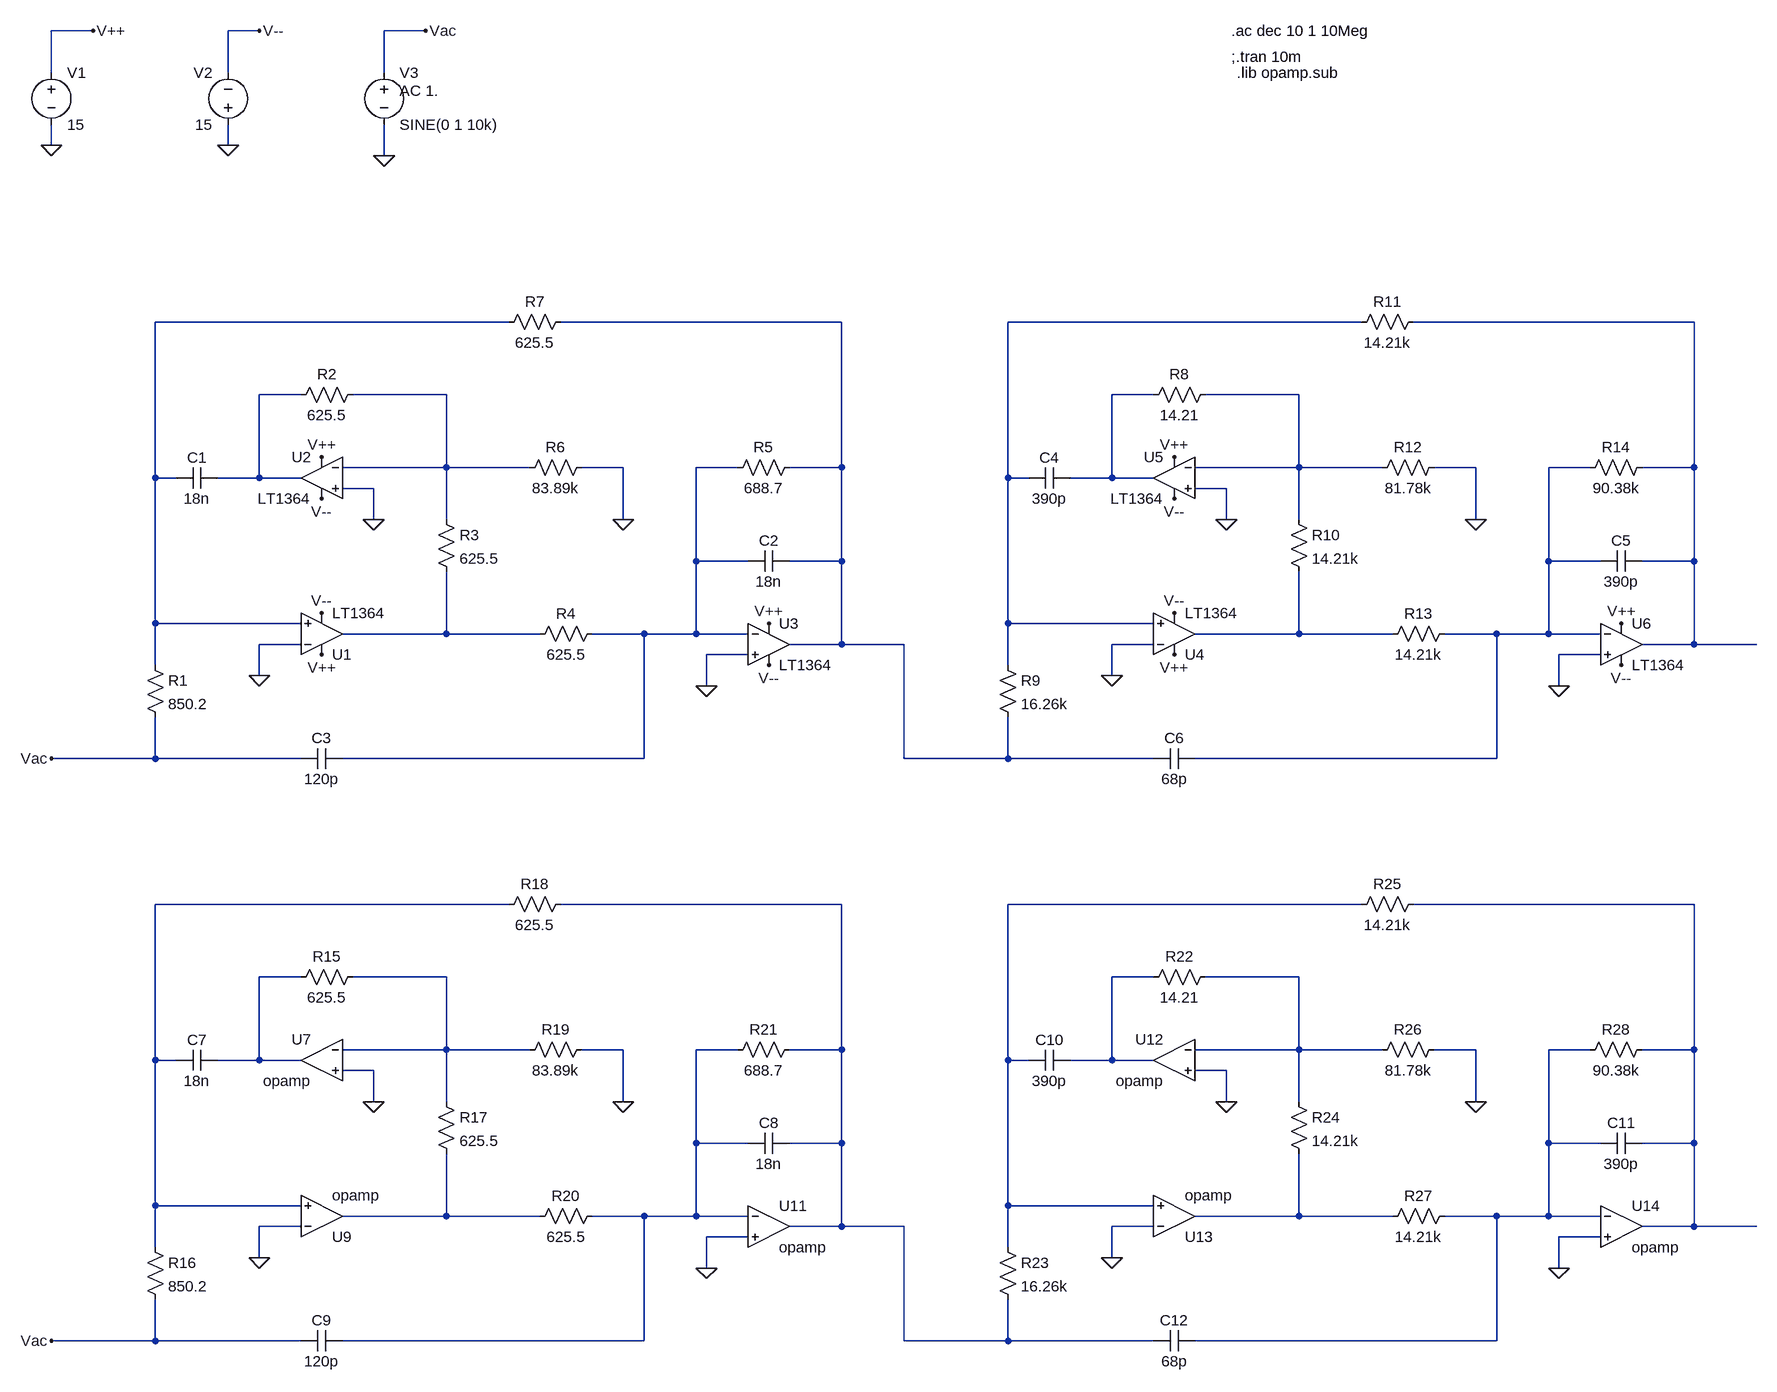
[diagram p0: schematic LT1364_Cauer_AM.asc]
LT1364_Cauer_AM.asc, the LTspice schematic file:
Version 4
SHEET 1 2456 1436
WIRE -304 -640 -368 -640
WIRE -48 -640 -96 -640
WIRE 208 -640 144 -640
WIRE -368 -576 -368 -640
WIRE -96 -576 -96 -640
WIRE 144 -576 144 -640
WIRE -368 -464 -368 -496
WIRE -96 -464 -96 -496
WIRE 144 -448 144 -496
WIRE 336 -192 -208 -192
WIRE 848 -192 416 -192
WIRE 1648 -192 1104 -192
WIRE 2160 -192 1728 -192
WIRE 16 -80 -48 -80
WIRE 240 -80 96 -80
WIRE 1328 -80 1264 -80
WIRE 1552 -80 1408 -80
WIRE 240 32 240 -80
WIRE 240 32 80 32
WIRE 368 32 240 32
WIRE 512 32 448 32
WIRE 688 32 624 32
WIRE 848 32 848 -192
WIRE 848 32 768 32
WIRE 1552 32 1552 -80
WIRE 1552 32 1392 32
WIRE 1680 32 1552 32
WIRE 1824 32 1760 32
WIRE 2000 32 1936 32
WIRE 2160 32 2160 -192
WIRE 2160 32 2080 32
WIRE -208 48 -208 -192
WIRE -176 48 -208 48
WIRE -48 48 -48 -80
WIRE -48 48 -112 48
WIRE 16 48 -48 48
WIRE 1104 48 1104 -192
WIRE 1136 48 1104 48
WIRE 1264 48 1264 -80
WIRE 1264 48 1200 48
WIRE 1328 48 1264 48
WIRE 128 64 80 64
WIRE 1440 64 1392 64
WIRE 128 112 128 64
WIRE 240 112 240 32
WIRE 512 112 512 32
WIRE 1440 112 1440 64
WIRE 1552 112 1552 32
WIRE 1824 112 1824 32
WIRE 624 176 624 32
WIRE 704 176 624 176
WIRE 848 176 848 32
WIRE 848 176 768 176
WIRE 1936 176 1936 32
WIRE 2016 176 1936 176
WIRE 2160 176 2160 32
WIRE 2160 176 2080 176
WIRE -208 272 -208 48
WIRE 16 272 -208 272
WIRE 1104 272 1104 48
WIRE 1328 272 1104 272
WIRE 240 288 240 192
WIRE 240 288 80 288
WIRE 384 288 240 288
WIRE 544 288 464 288
WIRE 624 288 624 176
WIRE 624 288 544 288
WIRE 704 288 624 288
WIRE 1552 288 1552 192
WIRE 1552 288 1392 288
WIRE 1696 288 1552 288
WIRE 1856 288 1776 288
WIRE 1936 288 1936 176
WIRE 1936 288 1856 288
WIRE 2016 288 1936 288
WIRE 16 304 -48 304
WIRE 848 304 848 176
WIRE 848 304 768 304
WIRE 944 304 848 304
WIRE 1328 304 1264 304
WIRE 2160 304 2160 176
WIRE 2160 304 2080 304
WIRE 2256 304 2160 304
WIRE 704 320 640 320
WIRE 2016 320 1952 320
WIRE -208 336 -208 272
WIRE 1104 336 1104 272
WIRE -48 352 -48 304
WIRE 1264 352 1264 304
WIRE 640 368 640 320
WIRE 1952 368 1952 320
WIRE -208 480 -208 416
WIRE -208 480 -368 480
WIRE 16 480 -208 480
WIRE 544 480 544 288
WIRE 544 480 80 480
WIRE 944 480 944 304
WIRE 1104 480 1104 416
WIRE 1104 480 944 480
WIRE 1328 480 1104 480
WIRE 1856 480 1856 288
WIRE 1856 480 1392 480
WIRE 336 704 -208 704
WIRE 848 704 416 704
WIRE 1648 704 1104 704
WIRE 2160 704 1728 704
WIRE 16 816 -48 816
WIRE 240 816 96 816
WIRE 1328 816 1264 816
WIRE 1552 816 1408 816
WIRE 240 928 240 816
WIRE 240 928 80 928
WIRE 368 928 240 928
WIRE 512 928 448 928
WIRE 688 928 624 928
WIRE 848 928 848 704
WIRE 848 928 768 928
WIRE 1552 928 1552 816
WIRE 1552 928 1392 928
WIRE 1680 928 1552 928
WIRE 1824 928 1760 928
WIRE 2000 928 1936 928
WIRE 2160 928 2160 704
WIRE 2160 928 2080 928
WIRE -208 944 -208 704
WIRE -176 944 -208 944
WIRE -48 944 -48 816
WIRE -48 944 -112 944
WIRE 16 944 -48 944
WIRE 1104 944 1104 704
WIRE 1136 944 1104 944
WIRE 1264 944 1264 816
WIRE 1264 944 1200 944
WIRE 1328 944 1264 944
WIRE 128 960 80 960
WIRE 1440 960 1392 960
WIRE 128 1008 128 960
WIRE 240 1008 240 928
WIRE 512 1008 512 928
WIRE 1440 1008 1440 960
WIRE 1552 1008 1552 928
WIRE 1824 1008 1824 928
WIRE 624 1072 624 928
WIRE 704 1072 624 1072
WIRE 848 1072 848 928
WIRE 848 1072 768 1072
WIRE 1936 1072 1936 928
WIRE 2016 1072 1936 1072
WIRE 2160 1072 2160 928
WIRE 2160 1072 2080 1072
WIRE -208 1168 -208 944
WIRE 16 1168 -208 1168
WIRE 1104 1168 1104 944
WIRE 1328 1168 1104 1168
WIRE 240 1184 240 1088
WIRE 240 1184 80 1184
WIRE 384 1184 240 1184
WIRE 544 1184 464 1184
WIRE 624 1184 624 1072
WIRE 624 1184 544 1184
WIRE 704 1184 624 1184
WIRE 1552 1184 1552 1088
WIRE 1552 1184 1392 1184
WIRE 1696 1184 1552 1184
WIRE 1856 1184 1776 1184
WIRE 1936 1184 1936 1072
WIRE 1936 1184 1856 1184
WIRE 2016 1184 1936 1184
WIRE 16 1200 -48 1200
WIRE 848 1200 848 1072
WIRE 848 1200 768 1200
WIRE 944 1200 848 1200
WIRE 1328 1200 1264 1200
WIRE 2160 1200 2160 1072
WIRE 2160 1200 2080 1200
WIRE 2256 1200 2160 1200
WIRE 704 1216 640 1216
WIRE 2016 1216 1952 1216
WIRE -208 1232 -208 1168
WIRE 1104 1232 1104 1168
WIRE -48 1248 -48 1200
WIRE 1264 1248 1264 1200
WIRE 640 1264 640 1216
WIRE 1952 1264 1952 1216
WIRE -208 1376 -208 1312
WIRE -208 1376 -368 1376
WIRE 16 1376 -208 1376
WIRE 544 1376 544 1184
WIRE 544 1376 80 1376
WIRE 944 1376 944 1200
WIRE 1104 1376 1104 1312
WIRE 1104 1376 944 1376
WIRE 1328 1376 1104 1376
WIRE 1856 1376 1856 1184
WIRE 1856 1376 1392 1376
FLAG -368 -464 0
FLAG -96 -464 0
FLAG -304 -640 V++
FLAG -48 -640 V--
FLAG 144 -448 0
FLAG 208 -640 Vac
FLAG 736 336 V--
FLAG 736 272 V++
FLAG 48 80 V--
FLAG 48 16 V++
FLAG 48 256 V--
FLAG 48 320 V++
FLAG 640 368 0
FLAG -48 352 0
FLAG 512 112 0
FLAG 128 112 0
FLAG 1952 368 0
FLAG 1264 352 0
FLAG 1824 112 0
FLAG 1440 112 0
FLAG -368 480 Vac
FLAG 640 1264 0
FLAG -48 1248 0
FLAG 512 1008 0
FLAG 128 1008 0
FLAG 1952 1264 0
FLAG 1264 1248 0
FLAG 1824 1008 0
FLAG 1440 1008 0
FLAG -368 1376 Vac
FLAG 2048 336 V--
FLAG 2048 272 V++
FLAG 1360 256 V--
FLAG 1360 320 V++
FLAG 1360 80 V--
FLAG 1360 16 V++
SYMBOL res 112 -96 R90
WINDOW 0 0 56 VBottom 2
WINDOW 3 32 56 VTop 2
SYMATTR InstName R2
SYMATTR Value 625.5
SYMBOL cap -112 32 R90
WINDOW 0 0 32 VBottom 2
WINDOW 3 32 32 VTop 2
SYMATTR InstName C1
SYMATTR Value 18n
SYMBOL res -224 320 R0
SYMATTR InstName R1
SYMATTR Value 850.2
SYMBOL res 224 96 R0
SYMATTR InstName R3
SYMATTR Value 625.5
SYMBOL cap 768 160 R90
WINDOW 0 0 32 VBottom 2
WINDOW 3 32 32 VTop 2
SYMATTR InstName C2
SYMATTR Value 18n
SYMBOL res 432 -208 R90
WINDOW 0 0 56 VBottom 2
WINDOW 3 32 56 VTop 2
SYMATTR InstName R7
SYMATTR Value 625.5
SYMBOL res 464 16 R90
WINDOW 0 0 56 VBottom 2
WINDOW 3 32 56 VTop 2
SYMATTR InstName R6
SYMATTR Value 83.89k
SYMBOL res 480 272 R90
WINDOW 0 0 56 VBottom 2
WINDOW 3 32 56 VTop 2
SYMATTR InstName R4
SYMATTR Value 625.5
SYMBOL cap 80 464 R90
WINDOW 0 0 32 VBottom 2
WINDOW 3 32 32 VTop 2
SYMATTR InstName C3
SYMATTR Value 120p
SYMBOL res 784 16 R90
WINDOW 0 0 56 VBottom 2
WINDOW 3 32 56 VTop 2
SYMATTR InstName R5
SYMATTR Value 688.7
SYMBOL voltage -368 -592 R0
WINDOW 123 0 0 Left 0
WINDOW 39 0 0 Left 0
SYMATTR InstName V1
SYMATTR Value 15
SYMBOL voltage -96 -480 R180
WINDOW 0 24 96 Left 2
WINDOW 3 24 16 Left 2
SYMATTR InstName V2
SYMATTR Value 15
SYMBOL voltage 144 -592 R0
WINDOW 123 24 44 Left 2
WINDOW 39 0 0 Left 0
SYMATTR Value2 AC 1.
SYMATTR InstName V3
SYMATTR Value SINE(0 1 10k)
SYMBOL Opamps\\LT1364 736 240 R0
SYMATTR InstName U3
SYMBOL Opamps\\LT1364 48 -16 M0
SYMATTR InstName U2
SYMBOL Opamps\\LT1364 48 352 M180
SYMATTR InstName U1
SYMBOL res 1424 -96 R90
WINDOW 0 0 56 VBottom 2
WINDOW 3 32 56 VTop 2
SYMATTR InstName R8
SYMATTR Value 14.21
SYMBOL cap 1200 32 R90
WINDOW 0 0 32 VBottom 2
WINDOW 3 32 32 VTop 2
SYMATTR InstName C4
SYMATTR Value 390p
SYMBOL res 1088 320 R0
SYMATTR InstName R9
SYMATTR Value 16.26k
SYMBOL res 1536 96 R0
SYMATTR InstName R10
SYMATTR Value 14.21k
SYMBOL cap 2080 160 R90
WINDOW 0 0 32 VBottom 2
WINDOW 3 32 32 VTop 2
SYMATTR InstName C5
SYMATTR Value 390p
SYMBOL res 1744 -208 R90
WINDOW 0 0 56 VBottom 2
WINDOW 3 32 56 VTop 2
SYMATTR InstName R11
SYMATTR Value 14.21k
SYMBOL res 1776 16 R90
WINDOW 0 0 56 VBottom 2
WINDOW 3 32 56 VTop 2
SYMATTR InstName R12
SYMATTR Value 81.78k
SYMBOL res 1792 272 R90
WINDOW 0 0 56 VBottom 2
WINDOW 3 32 56 VTop 2
SYMATTR InstName R13
SYMATTR Value 14.21k
SYMBOL cap 1392 464 R90
WINDOW 0 0 32 VBottom 2
WINDOW 3 32 32 VTop 2
SYMATTR InstName C6
SYMATTR Value 68p
SYMBOL res 2096 16 R90
WINDOW 0 0 56 VBottom 2
WINDOW 3 32 56 VTop 2
SYMATTR InstName R14
SYMATTR Value 90.38k
SYMBOL res 112 800 R90
WINDOW 0 0 56 VBottom 2
WINDOW 3 32 56 VTop 2
SYMATTR InstName R15
SYMATTR Value 625.5
SYMBOL cap -112 928 R90
WINDOW 0 0 32 VBottom 2
WINDOW 3 32 32 VTop 2
SYMATTR InstName C7
SYMATTR Value 18n
SYMBOL res -224 1216 R0
SYMATTR InstName R16
SYMATTR Value 850.2
SYMBOL res 224 992 R0
SYMATTR InstName R17
SYMATTR Value 625.5
SYMBOL cap 768 1056 R90
WINDOW 0 0 32 VBottom 2
WINDOW 3 32 32 VTop 2
SYMATTR InstName C8
SYMATTR Value 18n
SYMBOL res 432 688 R90
WINDOW 0 0 56 VBottom 2
WINDOW 3 32 56 VTop 2
SYMATTR InstName R18
SYMATTR Value 625.5
SYMBOL res 464 912 R90
WINDOW 0 0 56 VBottom 2
WINDOW 3 32 56 VTop 2
SYMATTR InstName R19
SYMATTR Value 83.89k
SYMBOL res 480 1168 R90
WINDOW 0 0 56 VBottom 2
WINDOW 3 32 56 VTop 2
SYMATTR InstName R20
SYMATTR Value 625.5
SYMBOL cap 80 1360 R90
WINDOW 0 0 32 VBottom 2
WINDOW 3 32 32 VTop 2
SYMATTR InstName C9
SYMATTR Value 120p
SYMBOL res 784 912 R90
WINDOW 0 0 56 VBottom 2
WINDOW 3 32 56 VTop 2
SYMATTR InstName R21
SYMATTR Value 688.7
SYMBOL Opamps\\opamp 48 880 M0
SYMATTR InstName U7
SYMATTR SpiceLine2 GBW=70Meg
SYMBOL Opamps\\opamp 48 1248 M180
SYMATTR InstName U9
SYMATTR SpiceLine2 GBW=70Meg
SYMBOL Opamps\\opamp 736 1136 R0
SYMATTR InstName U11
SYMATTR SpiceLine2 GBW=70Meg
SYMBOL res 1424 800 R90
WINDOW 0 0 56 VBottom 2
WINDOW 3 32 56 VTop 2
SYMATTR InstName R22
SYMATTR Value 14.21
SYMBOL cap 1200 928 R90
WINDOW 0 0 32 VBottom 2
WINDOW 3 32 32 VTop 2
SYMATTR InstName C10
SYMATTR Value 390p
SYMBOL res 1088 1216 R0
SYMATTR InstName R23
SYMATTR Value 16.26k
SYMBOL res 1536 992 R0
SYMATTR InstName R24
SYMATTR Value 14.21k
SYMBOL cap 2080 1056 R90
WINDOW 0 0 32 VBottom 2
WINDOW 3 32 32 VTop 2
SYMATTR InstName C11
SYMATTR Value 390p
SYMBOL res 1744 688 R90
WINDOW 0 0 56 VBottom 2
WINDOW 3 32 56 VTop 2
SYMATTR InstName R25
SYMATTR Value 14.21k
SYMBOL res 1776 912 R90
WINDOW 0 0 56 VBottom 2
WINDOW 3 32 56 VTop 2
SYMATTR InstName R26
SYMATTR Value 81.78k
SYMBOL res 1792 1168 R90
WINDOW 0 0 56 VBottom 2
WINDOW 3 32 56 VTop 2
SYMATTR InstName R27
SYMATTR Value 14.21k
SYMBOL cap 1392 1360 R90
WINDOW 0 0 32 VBottom 2
WINDOW 3 32 32 VTop 2
SYMATTR InstName C12
SYMATTR Value 68p
SYMBOL res 2096 912 R90
WINDOW 0 0 56 VBottom 2
WINDOW 3 32 56 VTop 2
SYMATTR InstName R28
SYMATTR Value 90.38k
SYMBOL Opamps\\opamp 1360 880 M0
SYMATTR InstName U12
SYMATTR SpiceLine2 GBW=70Meg
SYMBOL Opamps\\opamp 1360 1248 M180
SYMATTR InstName U13
SYMATTR SpiceLine2 GBW=70Meg
SYMBOL Opamps\\opamp 2048 1136 R0
SYMATTR InstName U14
SYMATTR SpiceLine2 GBW=70Meg
SYMBOL Opamps\\LT1364 2048 240 R0
SYMATTR InstName U6
SYMBOL Opamps\\LT1364 1360 352 M180
SYMATTR InstName U4
SYMBOL Opamps\\LT1364 1360 -16 M0
SYMATTR InstName U5
TEXT 1448 -640 Left 2 !.ac dec 10 1 10Meg
TEXT 1448 -600 Left 2 !;.tran 10m
TEXT 1456 -576 Left 2 !.lib opamp.sub

The netlist it stands for:
* LT1364_Cauer_AM.asc
R2 N006 N005 625.5
C1 N005 N001 18n
R1 N001 Vac 850.2
R3 N006 N011 625.5
C2 N002 N009 18n
R7 N002 N001 625.5
R6 0 N006 83.89k
R4 N009 N011 625.5
C3 N009 Vac 120p
R5 N002 N009 688.7
V1 V++ 0 15
V2 0 V-- 15
V3 Vac 0 SINE(0 1 10k) AC 1.
XU3 0 N009 V++ V-- N002 LT1363  ; LT1364, pins In+ In- V+ V- OUT
XU2 0 N006 V++ V-- N005 LT1363  ; LT1364, pins In+ In- V+ V- OUT
XU1 N001 0 V++ V-- N011 LT1363  ; LT1364, pins In+ In- V+ V- OUT
R8 N008 N007 14.21
C4 N007 N003 390p
R9 N003 N002 16.26k
R10 N008 N012 14.21k
C5 N004 N010 390p
R11 N004 N003 14.21k
R12 0 N008 81.78k
R13 N010 N012 14.21k
C6 N010 N002 68p
R14 N004 N010 90.38k
R15 N018 N017 625.5
C7 N017 N013 18n
R16 N013 Vac 850.2
R17 N018 N023 625.5
C8 N014 N021 18n
R18 N014 N013 625.5
R19 0 N018 83.89k
R20 N021 N023 625.5
C9 N021 Vac 120p
R21 N014 N021 688.7
XU7 N018 0 N017 opamp Aol=100K GBW=70Meg  ; pins invin noninvin out
XU9 0 N013 N023 opamp Aol=100K GBW=70Meg  ; pins invin noninvin out
XU11 N021 0 N014 opamp Aol=100K GBW=70Meg  ; pins invin noninvin out
R22 N020 N019 14.21
C10 N019 N015 390p
R23 N015 N014 16.26k
R24 N020 N024 14.21k
C11 N016 N022 390p
R25 N016 N015 14.21k
R26 0 N020 81.78k
R27 N022 N024 14.21k
C12 N022 N014 68p
R28 N016 N022 90.38k
XU12 N020 0 N019 opamp Aol=100K GBW=70Meg  ; pins invin noninvin out
XU13 0 N015 N024 opamp Aol=100K GBW=70Meg  ; pins invin noninvin out
XU14 N022 0 N016 opamp Aol=100K GBW=70Meg  ; pins invin noninvin out
XU6 0 N010 V++ V-- N004 LT1363  ; LT1364, pins In+ In- V+ V- OUT
XU4 N003 0 V++ V-- N012 LT1363  ; LT1364, pins In+ In- V+ V- OUT
XU5 0 N008 V++ V-- N007 LT1363  ; LT1364, pins In+ In- V+ V- OUT
.ac dec 10 1 10Meg
;.tran 10m
.lib opamp.sub
.lib LTC.lib
.backanno
.end